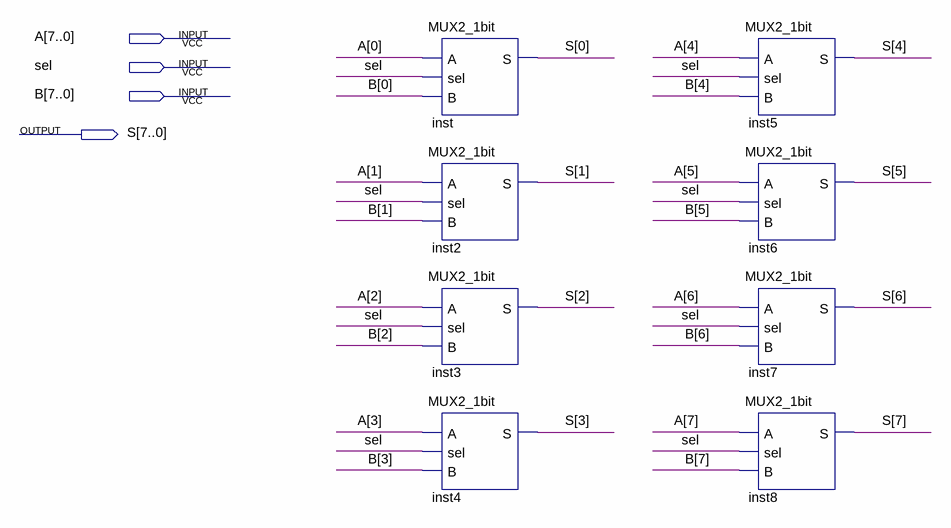
[diagram p0: schematic sheet]
// Quartus schematic MUX2_8bit.bdf as structural Verilog: 8 symbols, 4 pins
module MUX2_8bit (
  input  [7:0] A,
  input  sel,
  input  [7:0] B,
  output [7:0] S
);

  MUX2_1bit inst (.A(A[0]), .sel(sel), .B(B[0]), .S(S[0]));
  MUX2_1bit inst2 (.A(A[1]), .sel(sel), .B(B[1]), .S(S[1]));
  MUX2_1bit inst3 (.A(A[2]), .sel(sel), .B(B[2]), .S(S[2]));
  MUX2_1bit inst4 (.A(A[3]), .sel(sel), .B(B[3]), .S(S[3]));
  MUX2_1bit inst5 (.A(A[4]), .sel(sel), .B(B[4]), .S(S[4]));
  MUX2_1bit inst6 (.A(A[5]), .sel(sel), .B(B[5]), .S(S[5]));
  MUX2_1bit inst7 (.A(A[6]), .sel(sel), .B(B[6]), .S(S[6]));
  MUX2_1bit inst8 (.A(A[7]), .sel(sel), .B(B[7]), .S(S[7]));
endmodule
